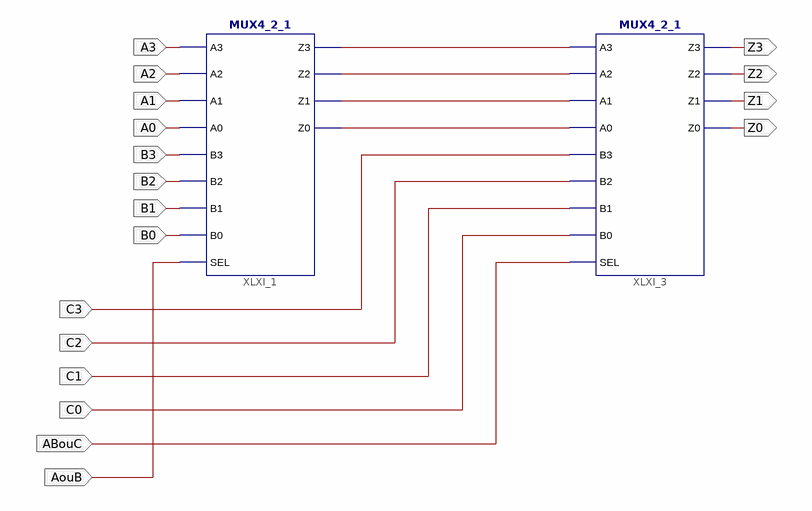
[diagram p0: schematic sheet 1]
// Xilinx ISE schematic MUX4_3_1.sch (spartan3) as structural Verilog: 2 symbols, 18 ports
module MUX4_3_1 (
  input  A3,
  input  A2,
  input  A1,
  input  A0,
  input  B3,
  input  B2,
  input  B1,
  input  B0,
  input  C3,
  input  C2,
  input  C1,
  input  C0,
  input  ABouC,
  input  AouB,
  output Z0,
  output Z1,
  output Z2,
  output Z3
);

  wire XLXN_15, XLXN_16, XLXN_17, XLXN_18;

  MUX4_2_1 XLXI_1 (
    .A0(A0), .A1(A1), .A2(A2), .A3(A3), .B0(B0), .B1(B1), .B2(B2), .B3(B3), .SEL(AouB), .Z0(XLXN_16),
    .Z1(XLXN_17), .Z2(XLXN_18), .Z3(XLXN_15));
  MUX4_2_1 XLXI_3 (
    .A0(XLXN_16), .A1(XLXN_17), .A2(XLXN_18), .A3(XLXN_15), .B0(C0), .B1(C1), .B2(C2), .B3(C3), .SEL(ABouC),
    .Z0(Z0), .Z1(Z1), .Z2(Z2), .Z3(Z3));
endmodule
